# EAGLE design RFDuino(I2C_V5) (EAGLE 6.5.0)
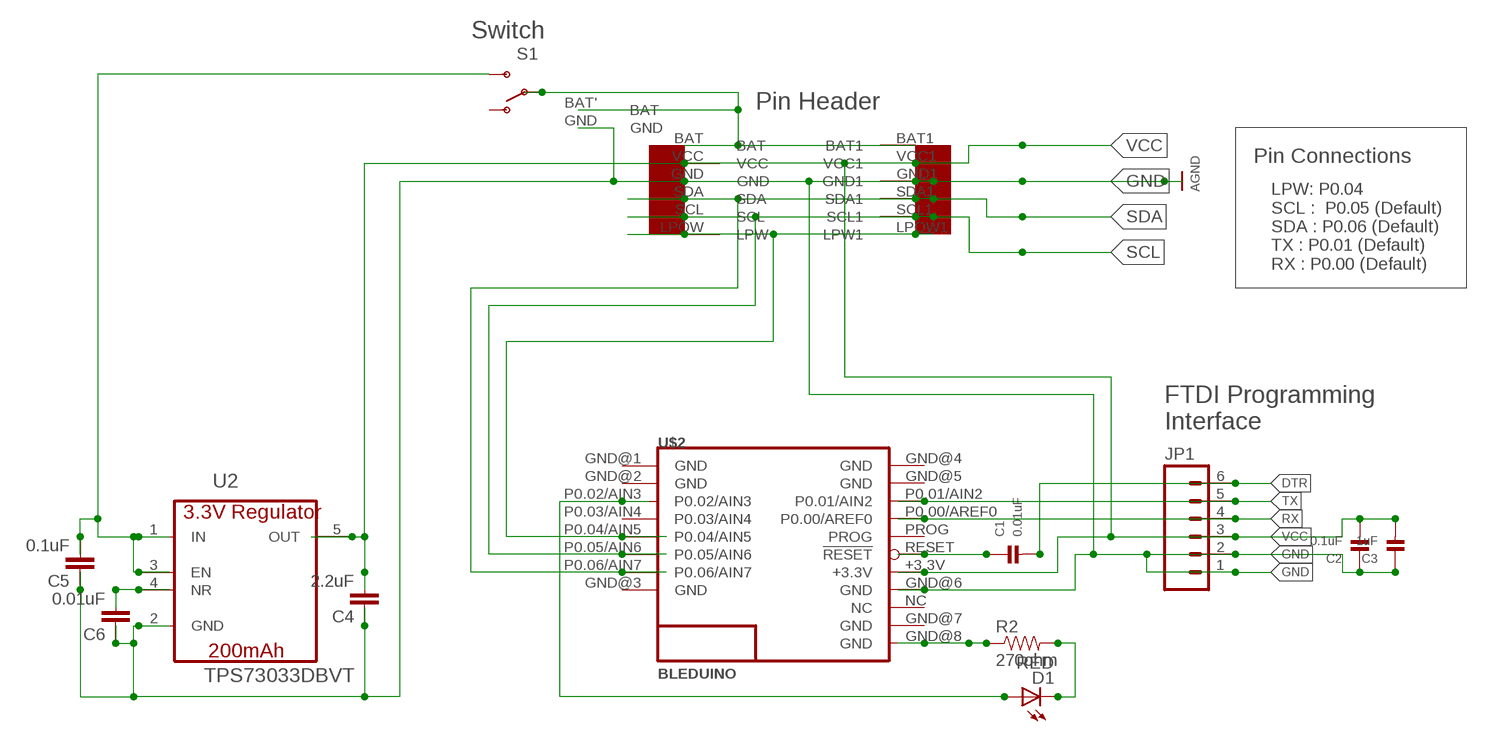
[diagram p0: schematic, sheet 1]

## Parts
C1  0.01uF  CAP_CERAMIC0402  [0402]
C2  0.1uF  CAP_CERAMIC0402  [0402]
C3  1uF  CAP_CERAMIC0402  [0402]
C4  2.2uF  CAP0402-CAP  [0402-CAP]
C5  0.1uF  CAP0402-CAP  [0402-CAP]
C6  0.01uF  CAP0402-CAP  [0402-CAP]
D1  RED  LED-RED0603  [LED-0603]
JP1  M06SIP  [1X06]
R2  270ohm  RESISTOR0402-RES  [0402-RES]
S1  SWITCH-SPDT-SMD-A  [SWITCH-SPST-SMD-A]
U2  TPS73033DBVT  [SOT95P290X145-5N]
U$1  EZ-I2CHEADERV1  [EZ-I2CHEADERV1]
U$2  BLEDUINO  [BLEDUINO]
U$4  MINI_BATTERY_HOLES  [MINI_BATTERY_HOLES]

## Nets
BAT: S1.2(P) U$1.BAT U$1.BAT1 U$4.BAT'(BAT)
BAT_INPUT: C5.2 S1.3(S) U2.1(IN) U2.3(EN)
DTR: C1.2 JP1.6
GND: C2.1 C3.1 C4.1 C5.1 C6.1 JP1.1 JP1.2 U2.2(GND) U$1.GND U$1.GND1 U$2.GND@6(GND) U$4.GND ; supply symbol labelled AGND
LPW: U$1.LPOW1(LPW1) U$1.LPOW(LPW) U$2.P0.04/AIN5
N$1: C1.1 U$2.RESET(!RESET)
N$5: D1.A U$2.P0.02/AIN3
N$7: C6.2 U2.4(NR)
N$19: D1.C R2.2
N$35: R2.1 U$2.GND@8(GND)
RX: JP1.4 U$2.P0.00/AREF0
SCL: U$1.SCL U$1.SCL1 U$2.P0.05/AIN6
SDA: U$1.SDA U$1.SDA1 U$2.P0.06/AIN7
TX: JP1.5 U$2.P0.01/AIN2
VCC: C2.2 C3.2 C4.2 JP1.3 U2.5(OUT) U$1.VCC U$1.VCC1 U$2.+3.3V
Unconnected: S1.1(O) U$2.GND@1(GND) U$2.GND@2(GND) U$2.GND@3(GND) U$2.GND@4(GND) U$2.GND@5(GND) U$2.GND@7(GND) U$2.NC U$2.P0.03/AIN4 U$2.PROG

## Notes on the sheet
- Switch
- Pin Header
- Pin Connections
- LPW: P0.04
  SCL :  P0.05 (Default)
  SDA : P0.06 (Default)
  TX : P0.01 (Default)
  RX : P0.00 (Default)
- FTDI Programming
  Interface

## Library data of the parts
C1-C3 = microbuilder:CAP_CERAMIC: Ceramic Capacitors 0402 - 0402 Surface Mount Capacitors 16pF 50V 5% [Digikey: 445-4899-2-ND] 18pF 50V 5% [Digikey: 490-1281-2-ND] 22pF 50V 5% [Digikey: 490-1283-2-ND] 68pF 50V 5% [Digikey: 490-1289-2-ND] 0.1uF 10V 10% [Digikey: 490-1318-2-ND] 1.0uF 6.3V 10% [Digikey: 490-1320-2-ND] 0603 - 0603 Surface Mount Capacitors 16 pF 50V 5% [Digikey: 445-5051-2-ND] 22 pF 50V [Digikey: PCC220ACVTR-ND] 33 pF 50V 5% [Digikey: 490-1415-1-ND] 56pF 50V 5% [Digikey: 490-1421-1-ND] 220pF 50V 5% [Digikey: 445-1285-1-ND] 680 pF 50V 2200 pF 50V 5% C0G [Digikey: 445-1297-1-ND] 5600 pF 100V 5% X7R [Digikey: 478-3711-1-ND] 0.1 µF 25V 10% [Digikey: PCC2277TR-ND] 0.22 µF 16V 10% X7R [Digikey: 445-1318-1-ND] 1.0 µF 25V 10% [Digikey: 445-5146-2-ND] 0603 - RF Specific 3pF 250V +/-0.1pF RF [Digikey: 712-1347-1-ND] 18 pF 250V 5% [Digikey: 478-3505-1-ND or 712-1322-1-ND] 56 pF 250V 5% C0G RF [Digikey: 490-4867-1-ND] 68 pF 250V RF [Digikey: 490-4868-1-ND] 0805 - 0805 Surface Mount Capacitors 220 pF 250V 2% RF Ceramic Capacitor [Digikey: 712-1398-1-ND] 1000 pF 50V 2% NP0 Ceramic Capacitor [Digikey: 478-3760-1-ND] 0.1 µF 25V 10% Ceramic Capacitor [Digikey: PCC1828TR-ND] 1.0 µF 16V 10% Ceramic Capacitor[Digikey: 490-1691-2-ND] 10.0 µF 10V 10% Ceramic Capacitor[Digikey: 709-1228-1-ND] 10.0 uF 16V 10% Ceramic Capacitor [Digikey: 478-5165-2-ND] 47 uF 6.3V 20% Ceramic Capacitor [Digikey: 587-1779-1-ND or 399-5506-1-ND] 1206 - 1206 Surface Mount Capacitors 47uF 10V 20% Ceramic Capacitor [Digikey: 490-5528-1-ND or 399-5508-1-ND or 445-6010-1-ND] 100uF 6.3V -20%, +80% Y5V Ceramic Capacitor (Digikey: 490-4512-1-ND, Mouser: 81-GRM31CF50J107ZE1L)
C4-C6 = SparkFun:CAP: Capacitor Standard 0603 ceramic capacitor, and 0.1" leaded capacitor.
D1 = SparkFun-LED:LED-RED: Assorted Red LEDs LilyPad 1206- DIO-09912 1206- DIO-00809 0603- DIO-00819; PROD_ID: DIO-00819
JP1 = SparkFun-Connectors:M06: Header 6 Standard 6-pin 0.1" header. Use with straight break away headers (SKU : PRT-00116), right angle break away headers (PRT-00553), swiss pins (PRT-00743), machine pins (PRT-00117), and female headers (PRT-00115). Molex polarized connector foot print use with SKU : PRT-08094 with associated crimp pins and housings. NOTES ON THE VARIANTS LOCK and LOCK_LONGPADS... This footprint was designed to help hold the alignment of a through-hole component (i.e. 6-pin header) while soldering it into place. You may notice that each hole has been shifted either up or down by 0.005 of an inch from it's more standard position (which is a perfectly straight line). This slight alteration caused the pins (the squares in the middle) to touch the edges of the holes. Because they are alternating, it causes a "brace" to hold the component in place. 0.005 has proven to be the perfect amount of "off-center" position when using our standard breakaway headers. Although looks a little odd when you look at the bare footprint, once you have a header in there, the alteration is very hard to notice. Also,if you push a header all the way into place, it is covered up entirely on the bottom side. This idea of altering the position of holes to aid alignment will be further integrated into the Sparkfun Library for other footprints. It can help hold any component with 3 or more connection pins.
R2 = SparkFun-Passives:RESISTOR: Resistor Basic schematic elements and footprints for 0603, 1206, and PTH resistors.
S1 = SparkFun-Electromechanical:SWITCH-SPDT: SPDT Switch Simple slide switch, Spark Fun Electronics SKU : COM-00102 DPDT SMT slide switch, AYZ0202, SWCH-08179
U2 = UniqueInteractionsLib:TPS73033DBVT: V REG LDO 0.2A +3.3V, SOT-23-5; MPN: TPS73033DBVT; OC_FARNELL: 1135395; OC_NEWARK: 71J8233; PACKAGE: SOT-23-5; SUPPLIER: TEXAS INSTRUMENTS
U$1 = UniqueInteractionsLib:EZ-I2CHEADERV1
U$2 = UniqueInteractionsLib:BLEDUINO
U$4 = UniqueInteractionsLib:MINI_BATTERY_HOLES

## Board
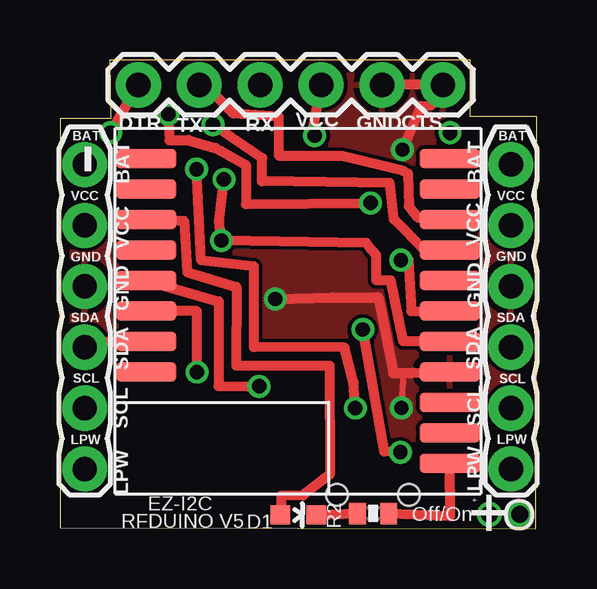
[diagram p1: board, top side]
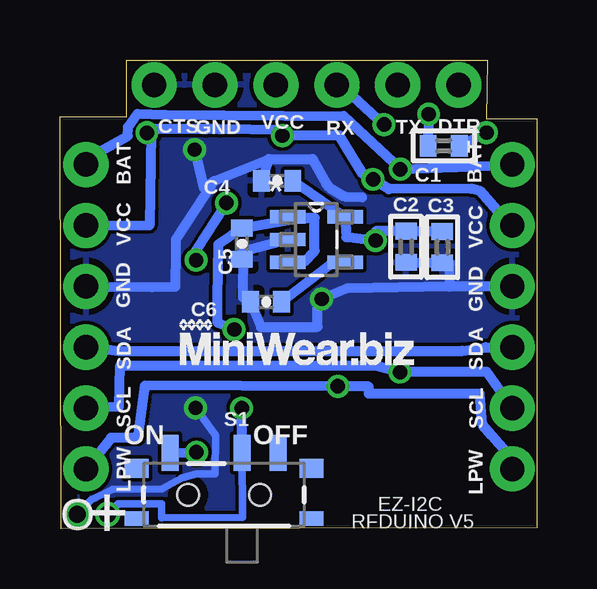
[diagram p2: board, bottom side, seen from below]

Size 19.89 x 19.56 mm. Coordinates in mm from the lower left corner, seen from the top.
Outline: 0,0.04 19.83,0 19.89,17.2 17.11,17.2 17.11,19.56 2.07,19.54 2.12,17.11 0.02,17.11 0,0.04
Copper layers (1*16): Top 0.0356mm / dielectric 1.5011mm / Bottom 0.0356mm
Design rules "oshParkPCBDesignRules": minimum track width 6mil, minimum drill 13mil, track to track 6mil, track to pad 6mil, pad to pad 6mil, via to via 6mil, smd to smd 6mil, copper to edge 15mil, drill to drill 6mil, minimum pad ring 7mil, minimum via ring 7mil, stop-mask expansion 3mil, vias tented up to drill 0mil, thermal gap 10mil

### Footprints (pad centres in the part's own frame; a part is rotated, then mirrored left to right if it is on the bottom)
0402 = smd 0.7 x 0.9: 1 -0.65,0; 2 0.65,0
0402-CAP = smd 0.7 x 0.9: 1 -0.65,0; 2 0.65,0
LED-0603 = smd 0.8 x 0.8: A 0,-0.75; C 0,0.75
1X06 = drill 1.016 pad 1.88: 1 0,0; 2 2.54,0; 3 5.08,0; 4 7.62,0; 5 10.16,0; 6 12.7,0
0402-RES = smd 0.7 x 0.9: 1 -0.65,0; 2 0.65,0
SWITCH-SPST-SMD-A = smd 0.7 x 1.5: 1 -2.25,-1.75; 2 -0.75,-1.75; 3 2.25,-1.75 | smd 1 x 0.6: GND1 -3.65,1; GND3 3.65,1 | smd 1 x 0.8: GND2 -3.65,-1.1; GND4 3.65,-1.1 | hole 0.9: -1.5,0; 1.5,0
SOT95P290X145-5N = smd 1.473 x 0.559: 1 -1.194,0.94; 2 -1.194,0; 3 -1.194,-0.94; 4 1.194,-0.94; 5 1.194,0.94
EZ-I2CHEADERV1 = drill 1.016 pad 1.88: BAT 0,-1.27; BAT1 17.78,-1.27; GND 0,-6.35; GND1 17.78,-6.35; LPOW 0,-13.97; LPOW1 17.78,-13.97; SCL 0,-11.43; SCL1 17.78,-11.43; SDA 0,-8.89; SDA1 17.78,-8.89; VCC 0,-3.81; VCC1 17.78,-3.81
BLEDUINO = smd 2.54 x 0.813: +3.3V 6.331,-2.54; GND@1 -6.331,5.08; GND@2 -6.331,3.81; GND@3 -6.331,-3.81; GND@4 6.331,5.08; GND@5 6.331,3.81; GND@6 6.331,-3.81; GND@7 6.331,-6.35; GND@8 6.331,-7.62; NC 6.331,-5.08; P0.00/AREF0 6.331,1.27; P0.01/AIN2 6.331,2.54; P0.02/AIN3 -6.331,2.54; P0.03/AIN4 -6.331,1.27; P0.04/AIN5 -6.331,0; P0.05/AIN6 -6.331,-1.27; P0.06/AIN7 -6.331,-2.54; PROG 6.331,0; RESET 6.331,-1.27
MINI_BATTERY_HOLES = drill 0.7 pad 1.016: BAT' 0.435,0.635; GND 0.435,-0.635

### Placement (x,y rotation side)
C1  3.89,15.98 0 bottom
C2  5.46,11.77 90 bottom
C3  3.95,11.75 90 bottom
C4  10.84,14.52 0 bottom
C5  12.31,11.9 90 bottom
C6  11.3,9.47 0 bottom
D1  9.94,0.59 270 top
JP1  15.97,18.52 180 top
R2  13.06,0.65 180 top
S1  13.05,1.43 180 bottom
U2  9.2,12.07 0 bottom
U$1  1.03,16.47 0 top
U$2  9.93,10.36 0 top
U$3  [LOGO2]  15,6.66 0 bottom
U$4  18.54,0.18 90 top

### Tracks (layer width: path | path; a pad name or v marks a point on that pad's centre or on a via)
BAT  (via drill 0.6)
  Top 0.406: v12.32,5.04 12.24,6.12 11.87,7.57 8.09,7.59 8.09,10.95 5.89,11.2 v5.7,15
  Bottom 0.305: U$4.BAT' 17.82,0.68 17.46,1.05 15.65,1.05 15.65,0.46 12.29,0.49 S1.2
  Bottom 0.406: 1.8,15.18 U$1.BAT 3.37,15.09 v5.7,15 8.07,17.22 15.49,17.27 16.66,17.32 17.06,16.76 17.07,16.39 18.81,15.43 U$1.BAT1 | S1.2 12.3,3.54 v12.32,5.04
BAT_INPUT  (via drill 0.6 pad 0.25)
  Top 0.406: v14.2,3.2 13.53,3.23 v12.63,8.32
  Bottom 0.406: U2.3 9.72,11.14 9.28,11.6 9.28,12.98 9.58,12.96 U2.1 10.39,12.89 C5.2 13.29,11.88 13.33,9.61 13.32,8.6 v12.63,8.32 | S1.3 v14.2,3.2
DTR  (via drill 0.6)
  Top 0.406: v2.11,16.53 JP1.6
  Bottom 0.406: C1.2 v2.11,16.53
GND  (via drill 0.6)
  Top 0.254: v14.24,5.05 14.34,6.46 14.39,6.51
  Top 0.406: v8.98,9.59 11.36,9.66 13.28,9.66 13.9,6.5 14.39,6.51 14.74,6.51 16.47,6.58 U$2.GND@6 | JP1.2 JP1.1 15.5,17.68 15.05,17.64 v14.28,15.82
  Bottom 0.305: U$4.GND 18.59,1.21 17.7,1.65 15.63,1.67 14.81,2.14 14.2,2.31 13.43,2.31 13.41,3.91 v14.24,5.05
  Bottom 0.406: U$1.GND 3.04,10.12 3.65,10.11 | 3.65,10.11 7.92,10.03 v8.98,9.59 9.16,9.77 9.15,8.43 11.51,8.42 C6.1 12.09,9.69 12.28,9.66 12.27,11.58 | U$1.GND1 16.04,10.09 15.08,10.11 15.06,11.58 15.06,12.09 13.46,14.52 | 13.46,14.52 11.18,15.43 | 11.18,15.43 9.36,15.43 8.79,14.38 8.65,14.24 8.03,13.87 7.3,13.84 | U2.2 12.27,11.58 | C5.1 12.27,11.58 | 11.18,15.43 C4.1 | v14.28,15.82 13.9,14.24 13.46,14.52 | C2.1 3.95,11.12 C3.1 3.65,11.1 3.65,10.11
  pour Top: -0.09,19.06 18.91,18.88 19.08,0.34 11.77,0.3 11.68,5.55 2.29,5.55 2.29,0.22 0.86,0.25
  pour Bottom: 0.8,0.24 2.29,0.27 2.29,5.55 11.59,5.45 11.68,0.33 18.99,0.33 19.9,18.93 0.94,18.88
LPW  (via drill 0.6)
  Top 0.406: U$2.P0.04/AIN5 6.62,9.49 6.61,5.96 7.86,5.94 v8.31,5.95
  Bottom 0.406: U$1.LPOW 1.27,3.18 1.88,3.88 2.28,4.35 2.39,5.64 7.01,5.64 7.01,5.94 v8.31,5.95 16.36,5.98 16.65,3.81 17.76,3.81 U$1.LPOW1
N$1  (via drill 0.6)
  Top 0.406: v14.22,11.21 14.54,11.22 14.65,9.09 16.21,9.04 U$2.RESET | v4.52,17.3 4.57,16.21 5.35,16.22 6.49,15.89 6.65,15.79 7.76,15.18 7.75,13.54 v12.95,13.6
  Bottom 0.406: v12.95,13.6 14.25,11.54 v14.22,11.21 | C1.1 v4.52,17.3
N$5
  Top 0.406: U$2.P0.02/AIN3 4.98,12.86 5.17,12.85 5.31,10.71 7.36,10.1 7.35,6.81 11.24,6.82 11.26,2.27 10.14,1.4 9.22,1.39 D1.A
N$7
  Bottom 0.406: U2.4 8.51,11.11 C6.2
N$19
  Top 0.406: D1.C R2.2
N$35
  Top 0.406: R2.1 16.28,0.54 U$2.GND@8
RX  (via drill 0.6)
  Top 0.406: U$2.P0.00/AREF0 16.5,11.55 15.29,11.55 13.92,12.92 13.75,14.43 8.42,14.5 8.43,15.47 v6.38,16.87
  Bottom 0.406: v6.38,16.87 7.94,18.3 JP1.4
SCL  (via drill 0.6)
  Top 0.406: v5.71,6.54 5.71,9.09 U$2.P0.05/AIN6
  Bottom 0.406: U$1.SCL 2.1,6.55 v5.71,6.54 6.72,6.82 17.38,6.83 17.43,5.11 U$1.SCL1
SDA
  Top 0.406: U$1.SDA 0.83,7.82 U$2.P0.06/AIN7
  Bottom 0.406: U$1.SDA1 18.46,7.58 17.44,7.43 3.12,7.43 2.14,7.58 U$1.SDA
TX
  Top 0.406: U$2.P0.01/AIN2 14.91,12.99 14.55,13.45 14.52,14.82 14.29,14.94 11.77,15.55 9.14,15.55 9.13,17.19 7.22,17.33 6.29,18.31 6.23,18.5 JP1.5
VCC  (via drill 0.6)
  Top 0.406: U$2.+3.3V 14.32,7.83 13.8,10.37 13.19,10.37 13.19,11.41 12.99,11.63 12.78,11.93 v6.73,12.03 6.64,12.83 v6.84,14.58 | JP1.3 10.46,16.34 v10.62,16.4
  Bottom 0.406: U$1.VCC1 16.16,12.67 16.1,16.52 v16.27,16.52 16.19,16.68 13.8,16.67 13.23,16.67 10.65,16.63 10.63,16.35 10.51,16.39 | C4.2 U2.5 7.95,12.17 7.83,12.17 v6.73,12.03 6.73,12.42 C2.2 5.46,12.4 C3.2 | U$1.VCC 1.1,12.73 1.08,12.61 2.36,14.08 2.74,14.19 6.18,14.17 v6.84,14.58 7.27,14.8 8.23,16.41 v10.62,16.4 | v10.62,16.4 10.51,16.39 | v10.62,16.4 10.78,16.4 10.51,16.39

### Text on the board
tNames: DTR | TX | RX | VCC | GND | CTS | EZ-I2C / RFDUINO V5 | + | Off/On | O
bNames: DTR | TX | RX | VCC | GND | CTS | OFF | ON | EZ-I2C / RFDUINO V5 | + | O